# EAGLE schematic H1DR1x-AD (EAGLE 9.6.0)
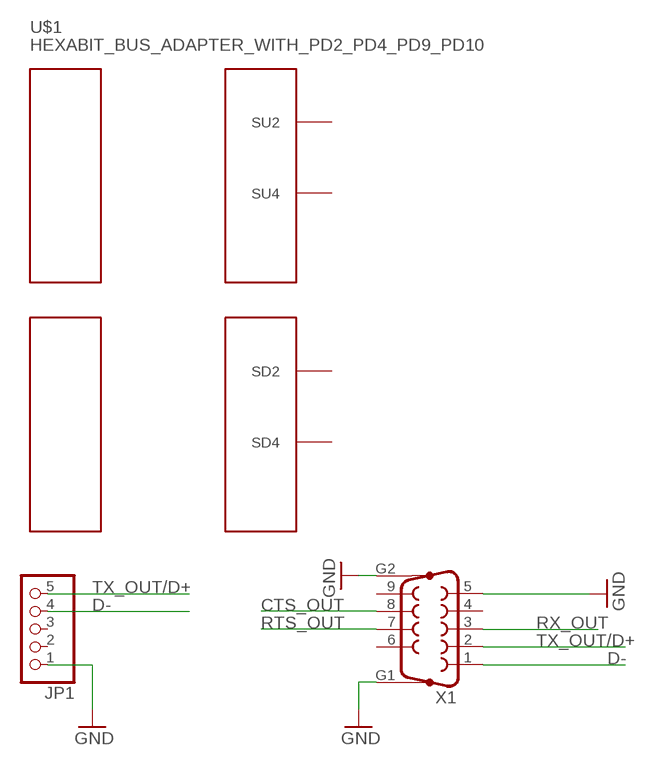
[diagram p0: schematic, sheet 1]

## Parts
JP1  PINHD-1X5  [F_1X05]
U$1  HEXABIT_BUS_ADAPTER_WITH_PD2_PD4_PD9_PD10  [HEXABIT_BUS_ADAPTER_WITH_P2_P4]
X1  F09HP  [F09HP]

## Nets
CTS_OUT: X1.8
D-: JP1.4 X1.1
GND: JP1.1 X1.5 X1.G1 X1.G2
RTS_OUT: X1.7
RX_OUT: X1.3
TX_OUT/D+: JP1.5 X1.2
Unconnected: JP1.2 JP1.3 U$1.PAD_PD2(SD2) U$1.PAD_PD4(SD4) U$1.PAD_PU2(SU2) U$1.PAD_PU4(SU4) X1.4 X1.6 X1.9

## Library data of the parts
JP1 = Hexabitz:PINHD-1X5: PIN HEADER Female right angle
U$1 = hexabitz_connectors:HEXABIT_BUS_ADAPTER_WITH_PD2_PD4_PD9_PD10
X1 = Hexabitz:F09HP: SUB-D; OC_FARNELL: unknown; OC_NEWARK: unknown